# EAGLE design 3MMLedBreakoutForArduino (EAGLE 6.5.0)
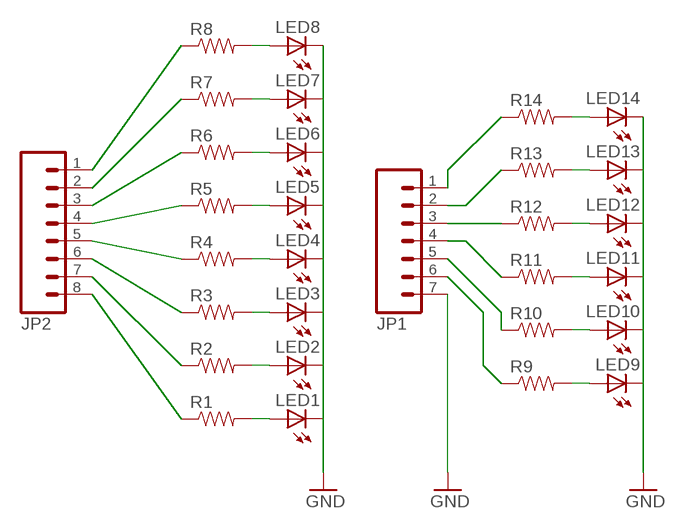
[diagram p0: schematic, sheet 1]

## Parts
JP1  M07  [1X07]
JP2  M081X08  [1X08]
LED1  LED3MM  [LED3MM]
LED2  LED3MM  [LED3MM]
LED3  LED3MM  [LED3MM]
LED4  LED3MM  [LED3MM]
LED5  LED3MM  [LED3MM]
LED6  LED3MM  [LED3MM]
LED7  LED3MM  [LED3MM]
LED8  LED3MM  [LED3MM]
LED9  LED3MM  [LED3MM]
LED10  LED3MM  [LED3MM]
LED11  LED3MM  [LED3MM]
LED12  LED3MM  [LED3MM]
LED13  LED3MM  [LED3MM]
LED14  LED3MM  [LED3MM]
R1  RESISTORAXIAL-0.3  [AXIAL-0.3]
R2  RESISTORAXIAL-0.3  [AXIAL-0.3]
R3  RESISTORAXIAL-0.3  [AXIAL-0.3]
R4  RESISTORAXIAL-0.3  [AXIAL-0.3]
R5  RESISTORAXIAL-0.3  [AXIAL-0.3]
R6  RESISTORAXIAL-0.3  [AXIAL-0.3]
R7  RESISTORAXIAL-0.3  [AXIAL-0.3]
R8  RESISTORAXIAL-0.3  [AXIAL-0.3]
R9  RESISTORAXIAL-0.3  [AXIAL-0.3]
R10  RESISTORAXIAL-0.3  [AXIAL-0.3]
R11  RESISTORAXIAL-0.3  [AXIAL-0.3]
R12  RESISTORAXIAL-0.3  [AXIAL-0.3]
R13  RESISTORAXIAL-0.3  [AXIAL-0.3]
R14  RESISTORAXIAL-0.3  [AXIAL-0.3]

## Nets
GND: JP1.7 LED1.K(C) LED2.K(C) LED3.K(C) LED4.K(C) LED5.K(C) LED6.K(C) LED7.K(C) LED8.K(C) LED9.K(C) LED10.K(C) LED11.K(C) LED12.K(C) LED13.K(C) LED14.K(C)
N$1: LED1.A R1.P$2
N$2: LED2.A R2.P$2
N$3: LED3.A R3.P$2
N$4: LED4.A R4.P$2
N$5: LED5.A R5.P$2
N$6: LED6.A R6.P$2
N$7: LED7.A R7.P$2
N$8: LED8.A R8.P$2
N$9: LED9.A R9.P$2
N$10: LED10.A R10.P$2
N$11: LED11.A R11.P$2
N$12: LED12.A R12.P$2
N$13: LED13.A R13.P$2
N$14: LED14.A R14.P$2
N$15: JP1.1 R14.P$1
N$16: JP1.2 R13.P$1
N$17: JP1.3 R12.P$1
N$18: JP1.4 R11.P$1
N$19: JP1.5 R10.P$1
N$20: JP1.6 R9.P$1
N$21: JP2.1 R8.P$1
N$22: JP2.2 R7.P$1
N$23: JP2.3 R6.P$1
N$24: JP2.4 R5.P$1
N$25: JP2.5 R4.P$1
N$26: JP2.6 R3.P$1
N$27: JP2.7 R2.P$1
N$28: JP2.8 R1.P$1

## Library data of the parts
JP1 = SparkFun-Connectors:M07: Header 7 Standard 7-pin 0.1" header. Use with straight break away headers (SKU : PRT-00116), right angle break away headers (PRT-00553), swiss pins (PRT-00743), machine pins (PRT-00117), and female headers (PRT-00115). NOTES ON THE VARIANTS LOCK and LOCK_LONGPADS... This footprint was designed to help hold the alignment of a through-hole component (i.e. 7-pin header) while soldering it into place. You may notice that each hole has been shifted either up or down by 0.005 of an inch from it's more standard position (which is usually a perfectly straight line). This slight alteration caused the pins (the squares in the middle) to touch the edges of the holes. Because they are alternating, it causes a "brace" to hold the header in place. 0.005 has proven to be the perfect amount of "off-center" position when using our standard breakaway headers. Although looks a little odd when you look at the bare footprint, once you have a header in there, the alteration is very hard to notice. Also, if you push a header all the way into place, it is covered up entirely on the bottom side. This idea of altering the position of holes to aid alignment will be further integrated into the Sparkfun Library for other footprints. It can help hold any component with 3 or more connection pins.
JP2 = SparkFun-Connectors:M08: Header 8 Standard 8-pin 0.1" header. Use with straight break away headers (SKU : PRT-00116), right angle break away headers (PRT-00553), swiss pins (PRT-00743), machine pins (PRT-00117), and female headers (PRT-00115).
LED1-LED14 = barbary_enterprises:LED: LEDs Standard schematic elements and footprints for 5mm, 3mm, 1206, and 0603 sized LEDs. 5mm - Spark Fun Electronics SKU : COM-00529 (and others)
R1-R14 = barbary_enterprises:RESISTOR: Resistor Basic schematic elements and footprints for 0603, 1206, and PTH resistors.

## Board
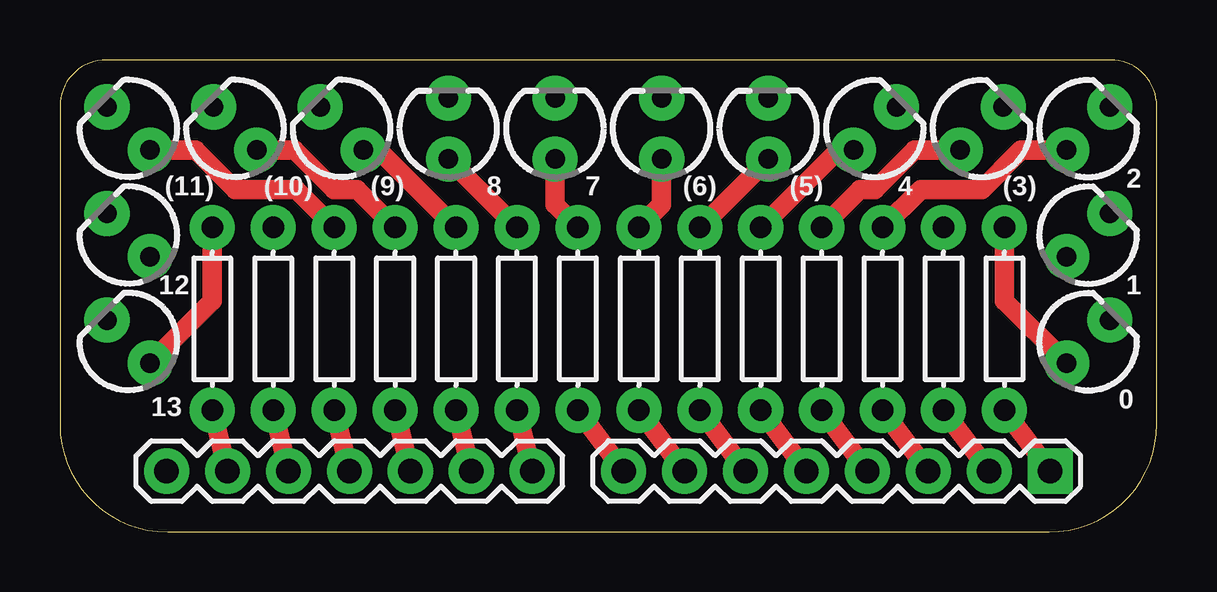
[diagram p1: board, top side]
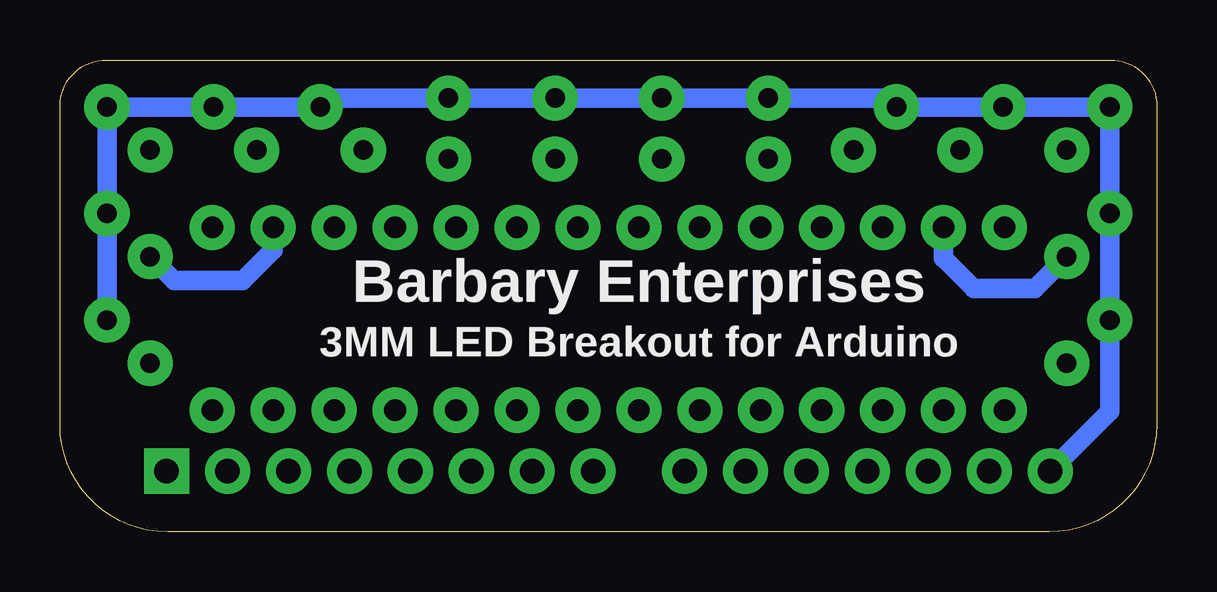
[diagram p2: board, bottom side, seen from below]

Size 45.72 x 19.68 mm. Coordinates in mm from the lower left corner, seen from the top.
Outline: 0,17.75 0,4.49 arc90 4.49,0 41.23,0 arc90 45.72,4.49 45.72,17.75 arc90 43.79,19.68 1.93,19.68 arc90 0,17.75
Copper layers (1*16): Top 0.0356mm / dielectric 1.5011mm / Bottom 0.0356mm
Design rules "LaenPCBOrder": minimum track width 6mil, minimum drill 13mil, track to track 6mil, track to pad 6mil, pad to pad 6mil, via to via 6mil, smd to smd 6mil, copper to edge 15mil, drill to drill 6mil, minimum pad ring 7mil, minimum via ring 7mil, stop-mask expansion 3mil, vias tented up to drill 0mil, thermal gap 10mil

### Footprints (pad centres in the part's own frame; a part is rotated, then mirrored left to right if it is on the bottom)
1X07 = drill 1.016 pad 1.88: 1 0,0; 2 2.54,0; 3 5.08,0; 4 7.62,0; 5 10.16,0; 6 12.7,0; 7 15.24,0
1X08 = drill 1.016 pad 1.88 square: 1 0,0 | drill 1.016 pad 1.88: 2 2.54,0; 3 5.08,0; 4 7.62,0; 5 10.16,0; 6 12.7,0; 7 15.24,0; 8 17.78,0
LED3MM = drill 0.813 pad 1.88: A -1.27,0; K 1.27,0
AXIAL-0.3 = drill 0.9 pad 1.88: P$1 -3.81,0; P$2 3.81,0

### Placement (x,y rotation side)
JP1  19.68,2.54 180 top
JP2  41.27,2.54 180 top
LED1  20.64,16.83 90 top
LED2  25.08,16.83 90 top
LED3  29.53,16.83 90 top
LED4  33.97,16.83 45 top
LED5  38.42,16.83 45 top
LED6  42.86,16.83 45 top
LED7  42.86,12.38 45 top
LED8  42.86,7.94 45 top
LED9  2.86,7.94 135 top
LED10  2.86,12.38 135 top
LED11  2.86,16.83 135 top
LED12  7.3,16.83 135 top
LED13  11.75,16.83 135 top
LED14  16.19,16.83 90 top
R1  21.59,8.89 90 top
R2  24.13,8.89 90 top
R3  26.67,8.89 90 top
R4  29.21,8.89 90 top
R5  31.75,8.89 90 top
R6  34.29,8.89 90 top
R7  36.83,8.89 90 top
R8  39.37,8.89 90 top
R9  6.35,8.89 90 top
R10  8.89,8.89 90 top
R11  11.43,8.89 90 top
R12  13.97,8.89 90 top
R13  16.51,8.89 90 top
R14  19.05,8.89 90 top

### Tracks (layer width: path | path; a pad name or v marks a point on that pad's centre or on a via)
GND
  Bottom 0.813: JP1.7 1.96,5.03 LED9.K LED10.K LED11.K LED12.K LED13.K 11.22,18.1 LED14.K LED1.K LED2.K LED3.K 34.5,18.1 LED4.K LED5.K LED6.K LED7.K LED8.K
N$1
  Top 0.813: R1.P$2 20.64,13.65 LED1.A
N$2
  Top 0.813: R2.P$2 25.08,13.65 LED2.A
N$3
  Top 0.813: R3.P$2 LED3.A
N$4
  Top 0.813: R4.P$2 32.44,15.93 LED4.A
N$5
  Top 0.813: R5.P$2 33.34,14.29 33.97,14.29 35.61,15.93 LED5.A
N$6
  Top 0.813: R6.P$2 35.88,14.29 38.42,14.29 40.06,15.93 LED6.A
N$7
  Bottom 0.813: LED7.A 40.96,10.48 38.1,10.48 36.83,11.75 R7.P$2
N$8
  Top 0.813: LED8.A 39.37,9.63 R8.P$2
N$9
  Top 0.813: LED9.A 6.35,9.63 R9.P$2
N$10
  Bottom 0.813: LED10.A 5.08,10.16 7.62,10.16 8.89,11.43 R10.P$2
N$11
  Top 0.813: R11.P$2 9.84,14.29 7.3,14.29 5.66,15.93 LED11.A
N$12
  Top 0.813: R12.P$2 12.38,14.29 11.43,14.29 9.79,15.93 LED12.A
N$13
  Top 0.813: R13.P$2 13.28,15.93 LED13.A
N$14
  Top 0.813: R14.P$2 LED14.A
N$15
  Top 0.813: JP1.1 R14.P$1
N$16
  Top 0.813: JP1.2 R13.P$1
N$17
  Top 0.813: JP1.3 R12.P$1
N$18
  Top 0.813: JP1.4 R11.P$1
N$19
  Top 0.813: JP1.5 R10.P$1
N$20
  Top 0.813: JP1.6 R9.P$1
N$21
  Top 0.813: JP2.1 R8.P$1
N$22
  Top 0.813: JP2.2 R7.P$1
N$23
  Top 0.813: JP2.3 R6.P$1
N$24
  Top 0.813: JP2.4 R5.P$1
N$25
  Top 0.813: JP2.5 R4.P$1
N$26
  Top 0.813: JP2.6 R3.P$1
N$27
  Top 0.813: JP2.7 R2.P$1
N$28
  Top 0.813: JP2.8 R1.P$1

### Text on the board
tPlace: 2 | (11) | (10) | (9) | 8 | 7 | (6) | (5) | 4 | (3) | 12 | 1 | 0 | 13
bPlace: Barbary Enterprises | 3MM LED Breakout for Arduino